# Altium schematic sheet Assembly.SchDoc: =ProjectName
size A4; Author: Hena Chernov; CompanyName: Catcatcat Electronics; Engineer: Hena Chernov; SheetNumber: 3; SheetTotal: 10; CodePhone: +380505759863; SheetDescription: Board Assembly Components
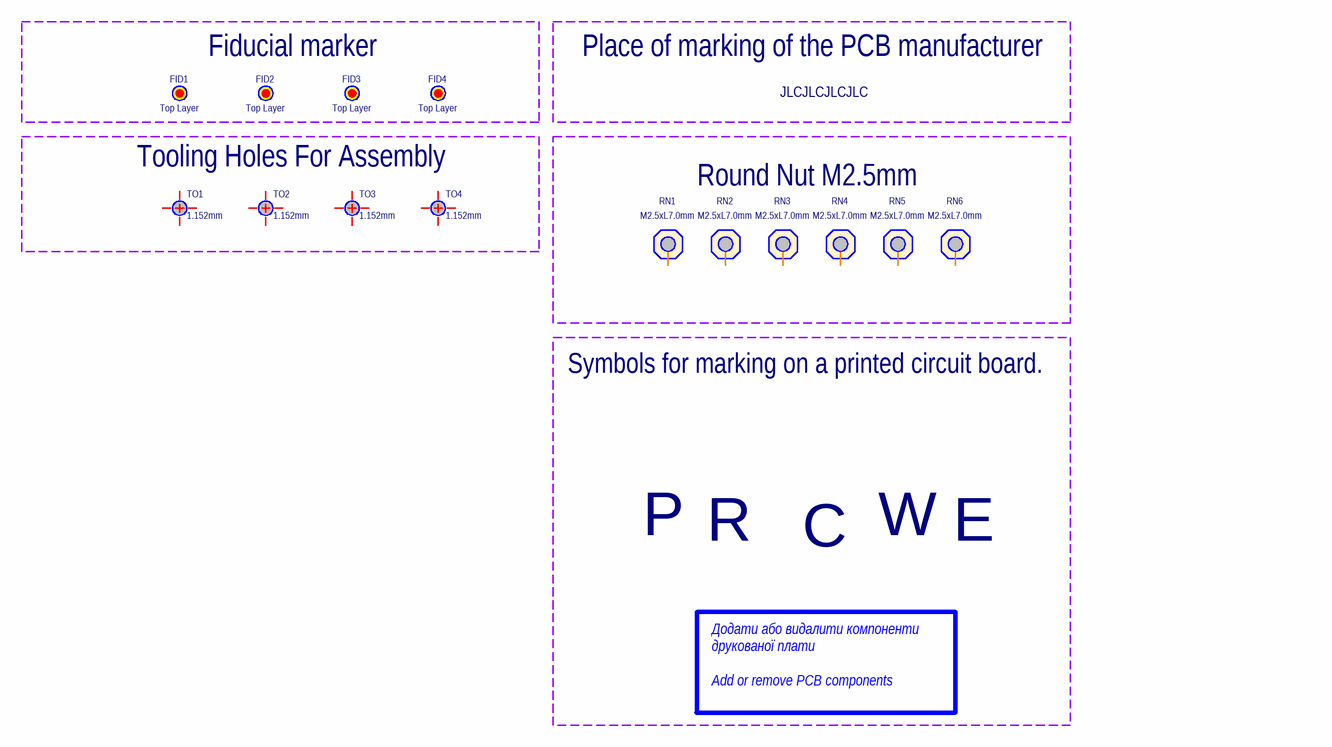
[diagram p0: Assembly.SchDoc]

## Parts
FID1  value Top Layer  [Fiducial marker top]  (hidden comment: Top(Bottom) Layer)  (no BOM)
FID2  value Top Layer  [Fiducial marker top]  (hidden comment: Top(Bottom) Layer)  (no BOM)
FID3  value Top Layer  [Fiducial marker top]  (hidden comment: Top(Bottom) Layer)  (no BOM)
FID4  value Top Layer  [Fiducial marker top]  (hidden comment: Top(Bottom) Layer)  (no BOM)
GS2  Graphic symbol  [_S_JLC]  (value not drawn)  (no BOM)
GS3  Graphic symbol  [_S_Pb-free]  (value not drawn)  (no BOM)
GS4  Graphic symbol  [_S_TR]  (value not drawn)  (no BOM)
GS5  Graphic symbol  [_S_R]  (value not drawn)  (no BOM)
GS6  Graphic symbol  [_S_ATTENTION2]  (value not drawn)  (no BOM)
GS7  Graphic symbol  [_S_CE]  (value not drawn)  (no BOM)
RN1  value M2.5xL7.0mm  [NUT2.5xL7.0]  (hidden comment: SMTSO2570CTJ)
RN2  value M2.5xL7.0mm  [NUT2.5xL7.0]  (hidden comment: SMTSO2570CTJ)
RN3  value M2.5xL7.0mm  [NUT2.5xL7.0]  (hidden comment: SMTSO2570CTJ)
RN4  value M2.5xL7.0mm  [NUT2.5xL7.0]  (hidden comment: SMTSO2570CTJ)
RN5  value M2.5xL7.0mm  [NUT2.5xL7.0]  (hidden comment: SMTSO2570CTJ)
RN6  value M2.5xL7.0mm  [NUT2.5xL7.0]  (hidden comment: SMTSO2570CTJ)
TO1  1.152mm  [Tooling_Holes_1.152MM]  (no BOM)
TO2  1.152mm  [Tooling_Holes_1.152MM]  (no BOM)
TO3  1.152mm  [Tooling_Holes_1.152MM]  (no BOM)
TO4  1.152mm  [Tooling_Holes_1.152MM]  (no BOM)

## Blocks framed on the sheet
Fiducial marker: FID1-FID4
Place of marking of the PCB manufacturer: GS2
Tooling Holes For Assembly: TO1-TO4
Round Nut M2.5mm: RN1-RN6
Symbols for marking on a printed circuit board.: GS3-GS7

## Nets

Not connected (* = marked no-connect by the designer): FID1 1; FID2 1; FID3 1; FID4 1; RN1 1; RN2 1; RN3 1; RN4 1; RN5 1; RN6 1; TO1 1; TO2 1; TO3 1; TO4 1

## Notes on the sheet
- Додати або видалити компоненти друкованої плати
  Add or remove PCB components
- Project Title:
- Project Version:
- Designed for:
- Lead Project
- Project ID:
- Development company
- Date:
- PCB Revision:
- PCB Name:
- Sheet Title:
- Assembly Variant:
- Time:
- Sheet
- of
- Engineer SCH:
- Engineer PCB:
- Inspection PRJ:
- Size: A4
- File:
- (in symbol _S_ATTENTION2) E
- (in symbol _S_JLC) JLCJLCJLCJLC
- (in symbol _S_PF) P
- (in symbol _S_R) R
- (in symbol _S_SE) C
- (in symbol _S_TR) W

## Library data of the parts
FID1-FID4 = Fiducial marker Top: For Assembly Top(Bottom) Layer; Assembly type: Fiducial Marker; Manufacturer Part Number 1: Fiducial Marker; Note: Fiducial marker; Case/Package: Fiducial Marker; Publisher: Catcatcat Electronics; Website developer: http://catcatcat.d-lan.dp.ua/; Footprint check status: Verified; Supplier URL 1: https://jlcpcb.com/parts/componentSearch?searchTxt=; Supplier 1: LCSC
GS2 = _S_JLC: Graphic symbol for marking on a PCB; Value: *; Assembly type: Graphic symbol; Note: Graphic symbol; Publisher: Catcatcat Electronics; Website developer: http://catcatcat.d-lan.dp.ua/; Footprint check status: Verified; Manufacturer Part Number 1: Graphic symbol; Case/Package: Graphic symbol; Supplier URL 1: https://jlcpcb.com/parts/componentSearch?searchTxt=
GS3 = _S_PF: Graphic symbol for marking on a PCB; Value: *; Assembly type: Graphic symbol; Note: Graphic symbol; Publisher: Catcatcat Electronics; Website developer: http://catcatcat.d-lan.dp.ua/; Footprint check status: Verified; Manufacturer Part Number 1: Graphic symbol; Case/Package: Graphic symbol; Supplier URL 1: https://jlcpcb.com/parts/componentSearch?searchTxt=
GS4 = _S_TR: Graphic symbol for marking on a PCB; Value: *; Assembly type: Graphic symbol; Note: Graphic symbol; Publisher: Catcatcat Electronics; Website developer: http://catcatcat.d-lan.dp.ua/; Footprint check status: Verified; Manufacturer Part Number 1: Graphic symbol; Case/Package: Graphic symbol; Supplier URL 1: https://jlcpcb.com/parts/componentSearch?searchTxt=
GS5 = _S_R: Graphic symbol for marking on a PCB; Value: *; Assembly type: Graphic symbol; Note: Graphic symbol; Publisher: Catcatcat Electronics; Website developer: http://catcatcat.d-lan.dp.ua/; Footprint check status: Verified; Manufacturer Part Number 1: Graphic symbol; Case/Package: Graphic symbol; Supplier URL 1: https://jlcpcb.com/parts/componentSearch?searchTxt=
GS6 = _S_ATTENTION2: Graphic symbol for marking on a PCB; Value: *; Assembly type: Graphic symbol; Note: Graphic symbol; Publisher: Catcatcat Electronics; Website developer: http://catcatcat.d-lan.dp.ua/; Footprint check status: Verified; Manufacturer Part Number 1: Graphic symbol; Case/Package: Graphic symbol; Supplier URL 1: https://jlcpcb.com/parts/componentSearch?searchTxt=
GS7 = _S_SE: Graphic symbol for marking on a PCB; Value: *; Assembly type: Graphic symbol; Note: Graphic symbol; Publisher: Catcatcat Electronics; Website developer: http://catcatcat.d-lan.dp.ua/; Footprint check status: Verified; Manufacturer Part Number 1: Graphic symbol; Case/Package: Graphic symbol; Supplier URL 1: https://jlcpcb.com/parts/componentSearch?searchTxt=
RN1-RN6 = Round Nut M2.5xL7.0S (E): Nuts Tinning Copper, M2.5 Round Nut L7.0mm; Manufacturer 1: Sinhoo; Detailed Description: Round Nut M2.5x5.56xLxx+1.53  Nuts ROHS; Assembly type: Extended Part; HelpURL: https://datasheet.lcsc.com/lcsc/2112061830_Sinhoo-SMTSO2570CTJ_C2916328.pdf; Manufacturer Part Number 1: SMTSO2570CTJ; Note: Round Nut; Case/Package: SMD-M2.5x5.56xLxx+1.53; Supplier Part Number 1: C2916328; Supplier Unit Price 1: 0.0965; Publisher: Catcatcat Electronics; Website developer: http://catcatcat.d-lan.dp.ua/; Footprint check status: Verified; Supplier URL 1: https://www.lcsc.com/product-detail/SMD-round-nut_Sinhoo-SMTSO2570CTJ_C2916328.html; Supplier 1: LCSC; MountType: SMD+TH
TO1-TO4 = Tooling_Holes_1.152MM: For Assembly; Note: Tooling Hole; Assembly type: Tooling Hole; Case/Package: Tooling Hole 1.152mm; Publisher: Catcatcat Electronics; Website developer: http://catcatcat.d-lan.dp.ua/; Footprint check status: Verified; Supplier URL 1: https://jlcpcb.com/parts/componentSearch?searchTxt=; Supplier 1: LCSC; Value: 1.152mm